# Altium schematic sheet apb.SchDoc
size A4
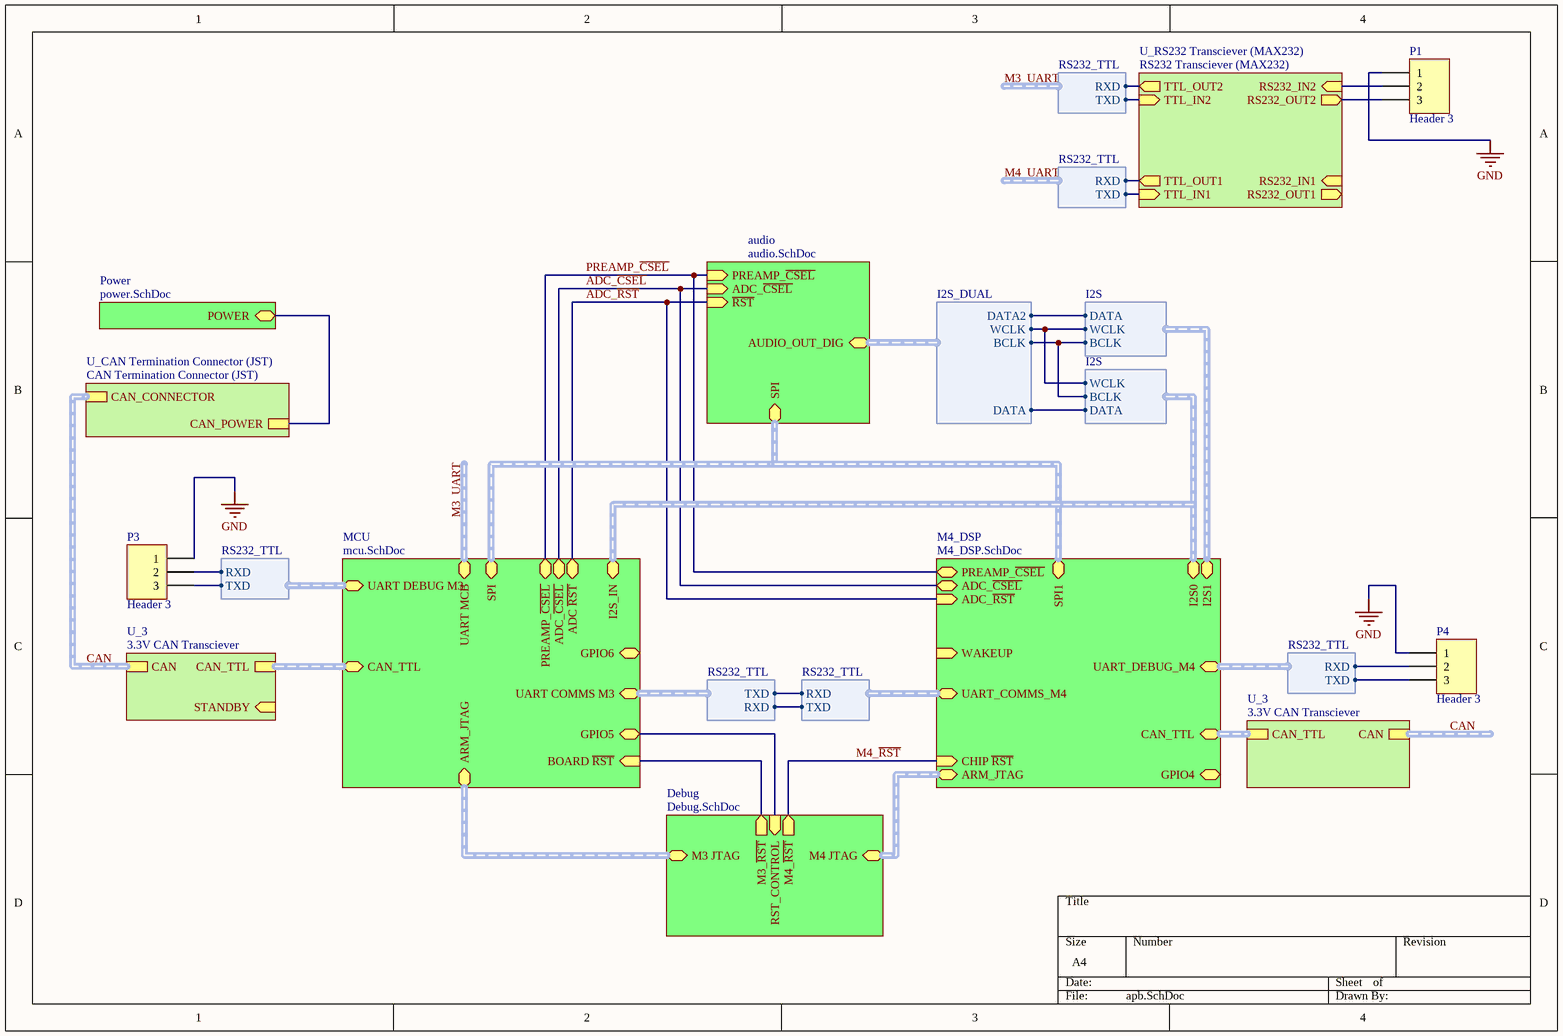
[diagram p0: apb.SchDoc]

## Parts
P1  Header 3  [S03B-PASK-2]
P3  Header 3  [HDR1X3]
P4  Header 3  [HDR1X3]

## Sub-sheets
audio = audio.SchDoc: AUDIO_OUT_DIG (harness I2S_DUAL), SPI (harness SPI_NOCSEL), PREAMP_~{CSEL} (in), ADC_~{CSEL} (in), ~{RST} (in)
Debug = Debug.SchDoc: M3 JTAG (harness ARM_JTAG), M4 JTAG (harness ARM_JTAG), M4_~{RST} (out), M3_~{RST} (out), RST_CONTROL (in)
M4_DSP = M4_DSP.SchDoc: UART_DEBUG_M4 (harness RS232_TTL), UART_COMMS_M4 (harness RS232_TTL), I2S0 (harness I2S), CAN_TTL (harness CAN_TTL), SPI1 (harness SPI_NOCSEL), I2S1 (harness I2S), PREAMP_~{CSEL} (bidir), ADC_~{CSEL} (bidir), GPIO4 (bidir), ARM_JTAG (harness ARM_JTAG), CHIP ~{RST} (in), ADC_~{RST} (in), WAKEUP (in)
MCU = mcu.SchDoc: CAN_TTL (harness CAN_TTL), I2S_IN (harness I2S), UART COMMS M3 (harness RS232_TTL), UART MCB (harness RS232_TTL), UART DEBUG M3 (harness RS232_TTL), SPI (harness SPI_NOCSEL), ARM_JTAG (harness ARM_JTAG), PREAMP_~{CSEL} (bidir), ADC_~{CSEL} (bidir), ADC ~{RST} (bidir), BOARD ~{RST} (in), GPIO5 (bidir), GPIO6 (bidir)
Power = power.SchDoc: POWER
U_3 = 3.3V CAN Transciever: CAN_TTL (harness CAN_TTL), CAN (harness CAN)
U_3 = 3.3V CAN Transciever: CAN_TTL (harness CAN_TTL), CAN (harness CAN), STANDBY (in)
U_CAN Termination Connector (JST) = CAN Termination Connector (JST): CAN_CONNECTOR (harness CAN), CAN_POWER
U_RS232 Transciever (MAX232) = RS232 Transciever (MAX232): TTL_IN1 (in), RS232_OUT1 (out), TTL_IN2 (in), RS232_OUT2 (out), RS232_IN1 (in), RS232_IN2 (in), TTL_OUT1 (out), TTL_OUT2 (out)

## Harnesses
RS232_TTL: RXD, TXD
I2S_DUAL: BCLK, DATA, DATA2, WCLK
I2S: BCLK, DATA, WCLK

## Nets
GND: P1.1 P3.1 P4.1
ADC_~{CSEL}: sheet MCU/ADC_~{CSEL}, sheet M4_DSP/ADC_~{CSEL}, sheet audio/ADC_~{CSEL}
ADC_~{RST}: sheet MCU/ADC ~{RST}, sheet M4_DSP/ADC_~{RST}, sheet audio/~{RST}
M3_UART.RXD: sheet U_RS232 Transciever (MAX232)/TTL_OUT2, sheet MCU/UART MCB.RXD
M3_UART.TXD: sheet U_RS232 Transciever (MAX232)/TTL_IN2, sheet MCU/UART MCB.TXD
M4_~{RST}: sheet M4_DSP/CHIP ~{RST}, sheet Debug/M4_~{RST}
M4_UART.RXD: sheet U_RS232 Transciever (MAX232)/TTL_OUT1, harness RS232_TTL.RXD
M4_UART.TXD: sheet U_RS232 Transciever (MAX232)/TTL_IN1, harness RS232_TTL.TXD
PREAMP_~{CSEL}: sheet MCU/PREAMP_~{CSEL}, sheet M4_DSP/PREAMP_~{CSEL}, sheet audio/PREAMP_~{CSEL}
NetP1_2: P1.2 ; sheet U_RS232 Transciever (MAX232)/RS232_IN2
NetP1_3: P1.3 ; sheet U_RS232 Transciever (MAX232)/RS232_OUT2
NetP3_2: P3.2 ; sheet MCU/UART DEBUG M3.RXD
NetP3_3: P3.3 ; sheet MCU/UART DEBUG M3.TXD
NetP4_2: P4.2 ; sheet M4_DSP/UART_DEBUG_M4.RXD
NetP4_3: P4.3 ; sheet M4_DSP/UART_DEBUG_M4.TXD
(unnamed): sheet MCU/BOARD ~{RST}, sheet Debug/M3_~{RST}
(unnamed): sheet MCU/GPIO5, sheet Debug/RST_CONTROL
(unnamed): sheet U_CAN Termination Connector (JST)/CAN_POWER, sheet Power/POWER
(unnamed): sheet MCU/UART COMMS M3.RXD, sheet M4_DSP/UART_COMMS_M4.TXD
(unnamed): sheet MCU/UART COMMS M3.TXD, sheet M4_DSP/UART_COMMS_M4.RXD
(unnamed): sheet audio/AUDIO_OUT_DIG.BCLK, sheet M4_DSP/I2S1.BCLK, sheet MCU/I2S_IN.BCLK
(unnamed): sheet audio/AUDIO_OUT_DIG.DATA, sheet MCU/I2S_IN.DATA
(unnamed): sheet audio/AUDIO_OUT_DIG.DATA2, sheet M4_DSP/I2S1.DATA
(unnamed): sheet audio/AUDIO_OUT_DIG.WCLK, sheet M4_DSP/I2S1.WCLK, sheet MCU/I2S_IN.WCLK

## Buses and harness runs
harness CAN = sheet U_3/CAN
harness CAN = sheet U_3/CAN = sheet U_CAN Termination Connector (JST)/CAN_CONNECTOR
harness M3_UART = sheet MCU/UART MCB
harness sheet audio/SPI = sheet M4_DSP/SPI1 = sheet MCU/SPI
harness sheet Debug/M3 JTAG = sheet MCU/ARM_JTAG
harness sheet Debug/M4 JTAG = sheet M4_DSP/ARM_JTAG
harness sheet M4_DSP/CAN_TTL = sheet U_3/CAN_TTL
harness sheet M4_DSP/I2S0 = sheet MCU/I2S_IN
harness sheet MCU/CAN_TTL = sheet U_3/CAN_TTL

## Library data of the parts
P1 P3 P4 = Header 3: Header, 3-Pin; LatestRevisionDate: 17-Jul-2002; LatestRevisionNote: Re-released for DXP Platform.; Publisher: Altium Limited